# Altium schematic sheet connect.SchDoc
size A4
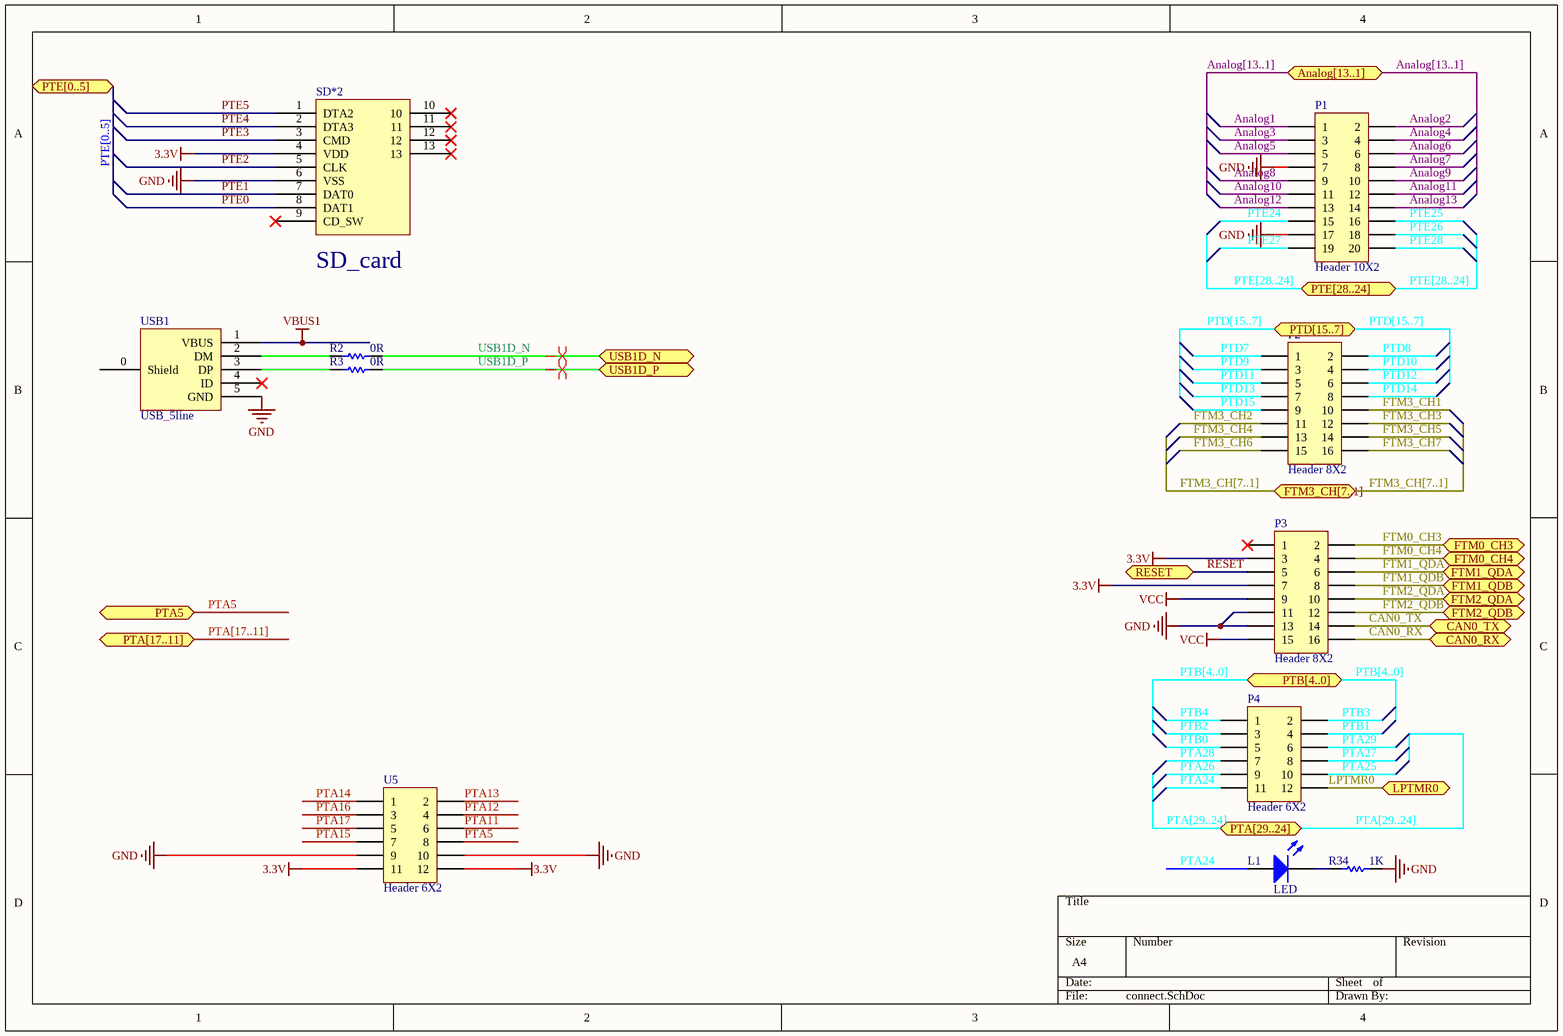
[diagram p0: connect.SchDoc]

## Parts
L1  LED  [1608[0603]]
P1  Header 10X2  [HDR2X10]
P2  Header 8X2  [HDR2X8]
P3  Header 8X2  [HDR2X8]
P4  Header 6X2  [HDR2X6]
R2  value 0R  [1608[0603]]  (hidden comment: Res)
R3  value 0R  [1608[0603]]  (hidden comment: Res)
R34  value 1K  [1608[0603]]  (hidden comment: Res)
SD*2  TF_card  [TF卡座(短体)]  (value not drawn)
U5  Header 6X2  [HDR2X6]
USB1  USB_5line  [USB-MICRO-5P-2F]

## Ports
Analog[13..1], CAN0_RX, CAN0_TX, FTM0_CH3, FTM0_CH4, FTM1_QDA, FTM1_QDB, FTM2_QDA, FTM2_QDB, FTM3_CH[7..1], LPTMR0, PTA5, PTA[17..11], PTA[29..24], PTB[4..0], PTD[15..7], PTE[0..5], PTE[28..24], RESET, USB1D_N, USB1D_P

## Nets
3.3V: P3.3 P3.7 SD*2.4(VDD) U5.11 U5.12
GND: P1.7 P1.17 P3.11 P3.13 R34.1 SD*2.6(VSS) U5.9 U5.10 USB1.5(GND)
VBUS1: USB1.1(VBUS)
VCC: P3.9 P3.15
Analog1: P1.1
Analog2: P1.2
Analog3: P1.3
Analog4: P1.4
Analog5: P1.5
Analog6: P1.6
Analog7: P1.8
Analog8: P1.9
Analog9: P1.10
Analog10: P1.11
Analog11: P1.12
Analog12: P1.13
Analog13: P1.14
CAN0_RX: P3.16 ; port CAN0_RX
CAN0_TX: P3.14 ; port CAN0_TX
FTM0_CH3: P3.2 ; port FTM0_CH3
FTM0_CH4: P3.4 ; port FTM0_CH4
FTM1_QDA: P3.6 ; port FTM1_QDA
FTM1_QDB: P3.8 ; port FTM1_QDB
FTM2_QDA: P3.10 ; port FTM2_QDA
FTM2_QDB: P3.12 ; port FTM2_QDB
FTM3_CH1: P2.10
FTM3_CH2: P2.11
FTM3_CH3: P2.12
FTM3_CH4: P2.13
FTM3_CH5: P2.14
FTM3_CH6: P2.15
FTM3_CH7: P2.16
LPTMR0: P4.12 ; port LPTMR0
PTA5: U5.8 ; port PTA5
PTA11: U5.6
PTA12: U5.4
PTA13: U5.2
PTA14: U5.1
PTA15: U5.7
PTA16: U5.3
PTA17: U5.5
PTA24: L1.1(A) P4.11
PTA25: P4.10
PTA26: P4.9
PTA27: P4.8
PTA28: P4.7
PTA29: P4.6
PTB0: P4.5
PTB1: P4.4
PTB2: P4.3
PTB3: P4.2
PTB4: P4.1
PTD7: P2.1
PTD8: P2.2
PTD9: P2.3
PTD10: P2.4
PTD11: P2.5
PTD12: P2.6
PTD13: P2.7
PTD14: P2.8
PTD15: P2.9
PTE0: SD*2.8(DAT1)
PTE1: SD*2.7(DAT0)
PTE2: SD*2.5(CLK)
PTE3: SD*2.3(CMD)
PTE4: SD*2.2(DTA3)
PTE5: SD*2.1(DTA2)
PTE24: P1.15
PTE25: P1.16
PTE26: P1.18
PTE27: P1.19
PTE28: P1.20
RESET: P3.5 ; port RESET
USB1D_N: R2.1 ; port USB1D_N
USB1D_P: R3.1 ; port USB1D_P
NetL1_2: L1.2(K) R34.2
NetR2_2: R2.2 USB1.2(DM)
NetR3_2: R3.2 USB1.3(DP)

Not connected (* = marked no-connect by the designer): P3 1*; SD*2 9(CD_SW)* 10* 11* 12* 13*; USB1 0(Shield) 4(ID)*

## Buses and harness runs
bus Analog[13..1] = port Analog[13..1]
bus FTM3_CH[7..1] = port FTM3_CH[7..1]
bus PTA[17..11] = port PTA[17..11]
bus PTA[29..24] = port PTA[29..24]
bus PTB[4..0] = port PTB[4..0]
bus PTD[15..7] = port PTD[15..7]
bus PTE[0..5] = port PTE[0..5]
bus PTE[28..24] = port PTE[28..24]

## Layout directives
differential pair: USB1D_N, USB1D_P

## Notes on the sheet
- (in symbol TF_card) SD_card

## Library data of the parts
P1 = Header 10X2: Header, 10-Pin, Dual row; LatestRevisionDate: 17-Jul-2002; LatestRevisionNote: Re-released for DXP Platform.; Publisher: Altium Limited
P2 P3 = Header 8X2: Header, 8-Pin, Dual row; LatestRevisionDate: 17-Jul-2002; LatestRevisionNote: Re-released for DXP Platform.; Publisher: Altium Limited
P4 U5 = Header 6X2: Header, 6-Pin, Dual row; LatestRevisionDate: 17-Jul-2002; LatestRevisionNote: Re-released for DXP Platform.; Publisher: Altium Limited
R2 R3 R34 = Res: 贴片电阻; Published: 8-Jun-2000; LatestRevisionDate: 17-Jul-2002; LatestRevisionNote: Re-released for DXP Platform.; PackageReference: AXIAL-0.3; Publisher: Altium Limited